# Altium schematic sheet hv_io_precharge.SchDoc
size A4; Organization: Badgerloop; Address1: 133 Engineering Research; Address2: Building; Address3: Madison, WI 53715
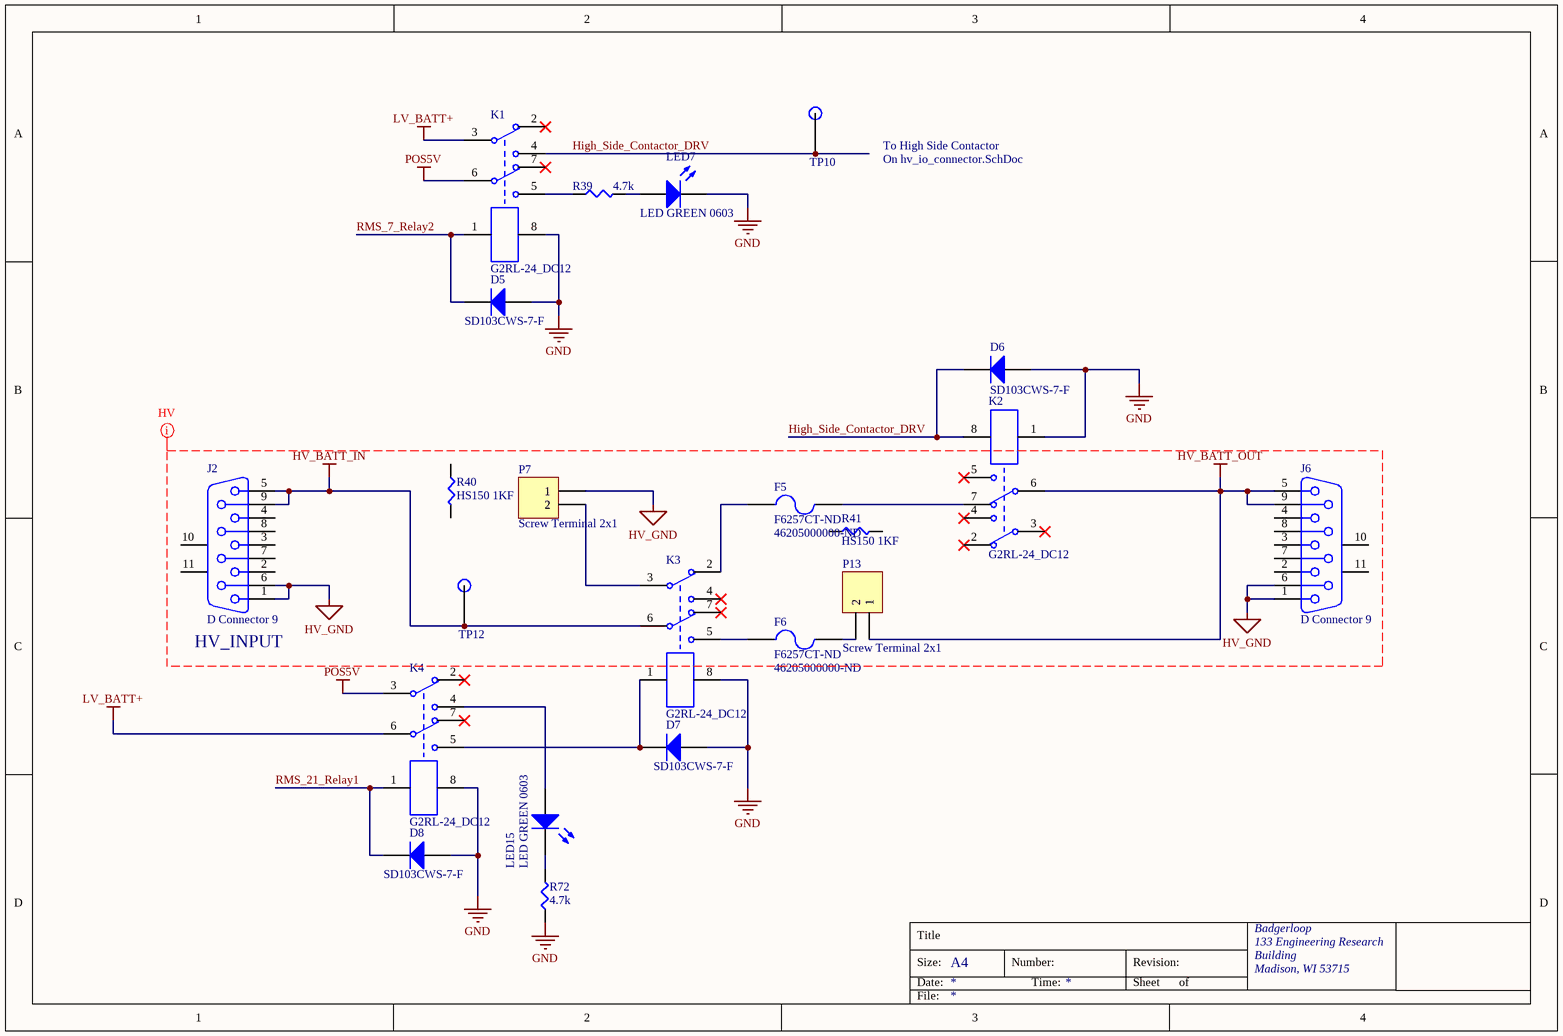
[diagram p0: hv_io_precharge.SchDoc]

## Parts
D5  SD103CWS-7-F  [SODFL250X110-2N]
D6  SD103CWS-7-F  [SODFL250X110-2N]
D7  SD103CWS-7-F  [SODFL250X110-2N]
D8  SD103CWS-7-F  [SODFL250X110-2N]
F5  F6257CT-ND  Supplier Part Number 1: 46205000000-ND  [F6257CT-ND]
F6  F6257CT-ND  Supplier Part Number 1: 46205000000-ND  [F6257CT-ND]
J2  D Connector 9  [DSUB1.385-2H9]
J6  D Connector 9  [DSUB1.385-2H9]
K1  G2RL-24_DC12  [G2RL]
K2  G2RL-24_DC12  [G2RL]
K3  G2RL-24_DC12  [G2RL]
K4  G2RL-24_DC12  [G2RL]
LED7  LED GREEN 0603  [LED 0603 GREEN]
LED15  LED GREEN 0603  [LED 0603 GREEN]
P7  Screw Terminal 2x1  [2POS TERM BLOCK]
P13  Screw Terminal 2x1  [2POS TERM BLOCK]
R39  4.7k  [SMD-0402-RES]
R40  HS150 1KF  [HS150 1KF]
R41  HS150 1KF  [HS150 1KF]
R72  4.7k  [SMD-0402-RES]
TP10  TP  [Test Point]  (value not drawn)
TP12  TP  [Test Point]  (value not drawn)

## Nets
GND: D5.1(A) D6.1(A) D7.1(A) D8.1(A) K1.8 K2.1 K3.8 K4.8 LED7.2(K) R72.1
HV_BATT_IN: J2.5 J2.9 K3.6 TP12.1
HV_BATT_OUT: J6.5 J6.9 K2.6 P13.1
HV_GND: J2.1 J2.6 J6.1 J6.6 P7.1
LV_BATT+: K1.3 K4.6
POS5V: K1.6 K4.3
High_Side_Contactor_DRV: D6.2(K) K1.4 K2.8 TP10.1
RMS_7_Relay2: D5.2(K) K1.1
RMS_21_Relay1: D8.2(K) K4.1
NetD7_2: D7.2(K) K3.1 K4.5
NetF5_1: F5.1 K3.2
NetF5_2: F5.2 K2.7
NetF6_1: F6.1 K3.5
NetF6_2: F6.2 P13.2
NetK1_5: K1.5 R39.1
NetK3_3: K3.3 P7.2
NetK4_4: K4.4 LED15.1(A)
NetLED7_1: LED7.1(A) R39.2
NetLED15_2: LED15.2(K) R72.2

Not connected (* = marked no-connect by the designer): J2 2 3 4 7 8 10(MH1) 11(MH2); J6 2 3 4 7 8 10(MH1) 11(MH2); K1 2* 7*; K2 2* 3* 4* 5*; K3 4* 7*; K4 2* 7*; R40 1 2; R41 1 2

## Layout directives
rule Power Plane Clearance [Clearance = 30mil]: HV_BATT_IN, HV_BATT_OUT, HV_GND

## Notes on the sheet
- To High Side Contactor
- On hv_io_connector.SchDoc
- (near J2) HV_INPUT
- Title
- Size:
- Date:
- A4
- Number:
- Time:
- Revision:
- Sheet
- of
- File:

## Library data of the parts
D5-D8 = Diode General Purpose_2: DIODE GEN PURP 20V 350MA SOD323; Manufacturer: Diodes Incorporated; Manufacturer P/N: SD103CWS-7-F; Digikey P/N: SD103CWS-FDIDKR-ND; Package / Case: SOD323; Do Not Populate: *; ComponentLink1Description: Digikey; ComponentLink1URL: https://www.digikey.com/product-detail/en/diodes-incorporated/SD103CWS-7-F/SD103CWS-FDIDKR-ND/1836772; ComponentLink2Description: Datasheet; ComponentLink2URL: https://www.diodes.com/assets/Datasheets/ds30101.pdf; ComponentLink3Description: Dimensions; ComponentLink3URL: https://www.diodes.com/assets/Package-Files/SOD323.pdf
F5 F6 = F6257CT-ND: FUSE BOARD MNT 500MA 350VAC/VDC; Manufacturer: Littelfuse; Manufacturer P/N: 46205000000; Voltage Rating (AC): 350V; Voltage Rating (DC): 250V; DC Cold Resistance: 227mR; Power Dissipation: 200W; Fuse Type: Board Mount (Cartridge Style Excluded); Approvals: UL,UMF; Digikey P/N: F6257CT-ND; Digikey Link: https://www.digikey.com/product-detail/en/littelfuse-inc/46205000000/F6257CT-ND/4331764; Supplier 1: Digi-Key; Manufacturer Part Number: 46205000000; Stock 1: 0; Mount: Surface Mount; Case/Package: SMD/SMT; Housing Material: Plastic; Min Operating Temperature: -40°C; Max Operating Temperature: 85°C; Package Quantity: 1500; Packaging: Tape and Reel; Current Rating: 500mA; Length: 10.5mm; Height: 0.177inch; Width: 0.177inch; Depth: 4.5mm; Lead Free: Lead Free; ComponentLink1URL: http://www.littelfuse.com/~/media/electronics/datasheets/fuses/littelfuse_fuse_462_datasheet.pdf.pdf?src-supplier=Digi-Key; ComponentLink1Description: http://www.littelfuse.com/~/media/electronics/datasheets/fuses/littelfuse_fuse_462_datasheet.pdf.pdf?src-supplier=Digi-Key; ComponentLink2URL: http://www.mouser.com/ds/2/240/Littelfuse_Fuse_462-33205.pdf?src-supplier=Mouser; ComponentLink2Description: http://www.mouser.com/ds/2/240/Littelfuse_Fuse_462-33205.pdf?src-supplier=Mouser; ComponentLink3URL: http://www.littelfuse.com/data/en/Data_Sheets/Littelfuse_Fuse_462.pdf?src-supplier=Digi-Key; ComponentLink3Description: http://www.littelfuse.com/data/en/Data_Sheets/Littelfuse_Fuse_462.pdf?src-supplier=Digi-Key
J2 J6 = D Connector 9: Receptacle Assembly, 9 Position, Right Angle; PackageDocument: O; Positions: 9; Published: 15-Jun-2001; LatestRevisionDate: 17-Jul-2002; LatestRevisionNote: Re-released for DXP Platform.; DatasheetDocument: 1-Sep-1999; PackageReference: 788750; Publisher: Altium Limited; Orientation: Right Angle; Gender: Receptacle
K1-K4 = G2RL-24_DC12: RELAY GEN PURPOSE DPDT 8A 12V; Manufacturer: Omron Electronics; Manufacturer P/N: G2RL-24 DC12; Digikey Link: https://www.digikey.com/product-detail/en/omron-electronics-inc-emc-div/G2RL-24-DC12/Z147-ND/307667; Digikey P/N: Z147-ND
LED7 LED15 = LED GREEN 0603: Manufacturer: Lite-On Inc.; Manufacturer P/N: LTST-C190KGKT; Digikey P/N: 160-1435-1-ND; Package / Case: 0603; Color: GREEN
P7 P13 = Screw Terminal 2x1: Screw Terminal, 2-Pin
R39 R72 = ERJ-2GEJ472X: RES SMD 4.7K OHM 5% 1/10W 0402; Manufacturer: Panasonic Electronic Components; Factory Stock: 0; Unit Price (USD): 0.00350; @ qty: 1500; Minimum Quantity: 1; Power (Watts): 0.1W, 1/10W; Temperature Coefficient: ±200ppm/°C; Part Number: ERJ-2GEJ472X; Datasheets: http://industrial.panasonic.com/www-cgi/jvcr13pz.cgi?E+PZ+3+AOA0001+ERJ2GEJ472X+7+WW; Image: //media.digikey.com/Photos/Panasonic%20Photos/ERJ-PA2-Series.jpg; Digi-Key Part Number: P4.7KJCT-ND; Quantity Available: 8551774; Packaging: Cut Tape (CT); Series: ERJ; Part Status: Active; Value: 4.7k; Tolerance: ±5%; Composition: Thick Film; Features: Automotive AEC-Q200; Operating Temperature: -55°C ~ 155°C; Package / Case: 0402 (1005 Metric); Supplier Device Package: 0402; Size / Dimension: 0.039" L x 0.020" W (1.00mm x 0.50mm); Height - Seated (Max): 0.016" (0.40mm); Number of Terminations: 2; Failure Rate: -; Digikey P/N: ERJ-2GEJ472X
R40 R41 = HS150 1KF: 1K Power Resistor; Manufacturer: Ohmite; Digikey Link: https://www.digikey.com/product-detail/en/ohmite/HS150-1KF/HS1501KF-ND/5306251; Digikey P/N: HS1501KF-ND; Manufacturer P/N: HS150 1KF